# Altium schematic sheet AD7616_BLOCK_B.SchDoc
size A4; SheetNumber: 3; SheetTotal: 16
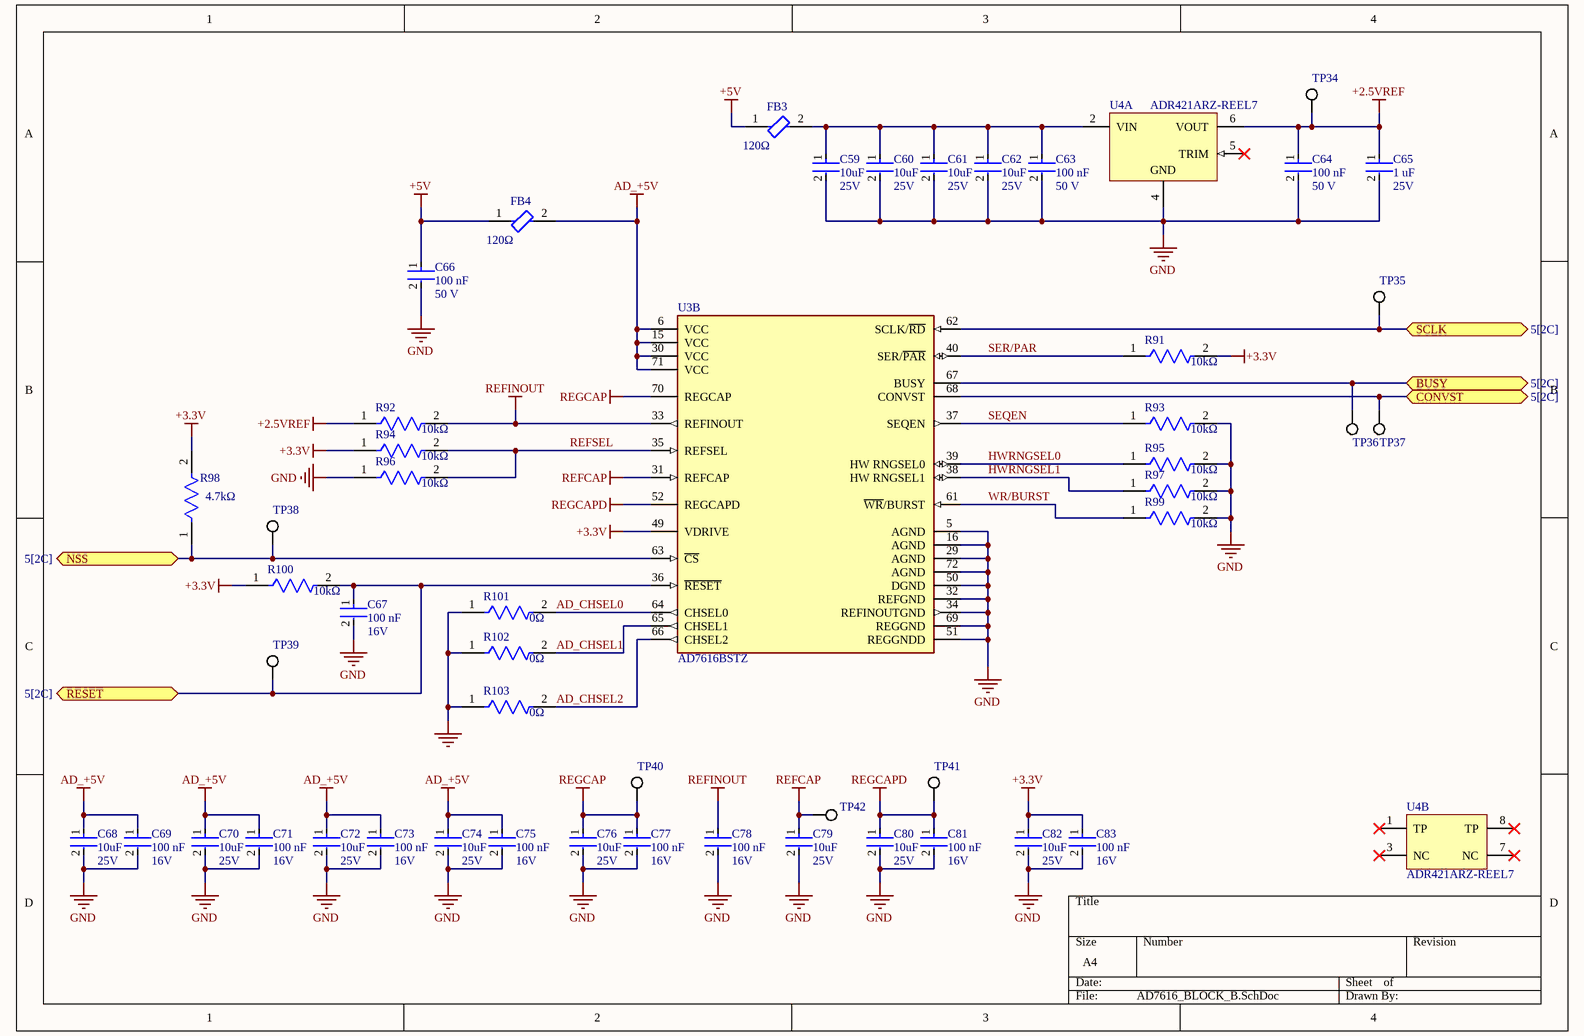
[diagram p0: AD7616_BLOCK_B.SchDoc]

## Parts
C59  Voltage Rating: 25V  Capacitance: 10uF  [FP-C1608-080-IPC_B]  (hidden comment: C1608X5R1E106M080AC)
C60  Voltage Rating: 25V  Capacitance: 10uF  [FP-C1608-080-IPC_B]  (hidden comment: C1608X5R1E106M080AC)
C61  Voltage Rating: 25V  Capacitance: 10uF  [FP-C1608-080-IPC_B]  (hidden comment: C1608X5R1E106M080AC)
C62  Voltage Rating: 25V  Capacitance: 10uF  [FP-C1608-080-IPC_B]  (hidden comment: C1608X5R1E106M080AC)
C63  value 100 nF  Voltage Rating: 50 V  [FP-C0603C-CF-IPC_B]  (hidden comment: C0603C104M5RACTU)
C64  value 100 nF  Voltage Rating: 50 V  [FP-C0603C-CF-IPC_B]  (hidden comment: C0603C104M5RACTU)
C65  Capacitance: 1 uF  Voltage Rating: 25V  [FP-GCM188-0_1-IPC_B]  (hidden comment: GCM188R71E105KA64D)
C66  value 100 nF  Voltage Rating: 50 V  [FP-C0603C-CF-IPC_B]  (hidden comment: C0603C104M5RACTU)
C67  Capacitance: 100 nF  Voltage Rating: 16V  [FP-CL752-IPC_B]  (hidden comment: CL05B104KO5VPNC)
C68  Voltage Rating: 25V  Capacitance: 10uF  [FP-C1608-080-IPC_B]  (hidden comment: C1608X5R1E106M080AC)
C69  Capacitance: 100 nF  Voltage Rating: 16V  [FP-CL752-IPC_B]  (hidden comment: CL05B104KO5VPNC)
C70  Voltage Rating: 25V  Capacitance: 10uF  [FP-C1608-080-IPC_B]  (hidden comment: C1608X5R1E106M080AC)
C71  Capacitance: 100 nF  Voltage Rating: 16V  [FP-CL752-IPC_B]  (hidden comment: CL05B104KO5VPNC)
C72  Voltage Rating: 25V  Capacitance: 10uF  [FP-C1608-080-IPC_B]  (hidden comment: C1608X5R1E106M080AC)
C73  Capacitance: 100 nF  Voltage Rating: 16V  [FP-CL752-IPC_B]  (hidden comment: CL05B104KO5VPNC)
C74  Voltage Rating: 25V  Capacitance: 10uF  [FP-C1608-080-IPC_B]  (hidden comment: C1608X5R1E106M080AC)
C75  Capacitance: 100 nF  Voltage Rating: 16V  [FP-CL752-IPC_B]  (hidden comment: CL05B104KO5VPNC)
C76  Voltage Rating: 25V  Capacitance: 10uF  [FP-C1608-080-IPC_B]  (hidden comment: C1608X5R1E106M080AC)
C77  Capacitance: 100 nF  Voltage Rating: 16V  [FP-CL752-IPC_B]  (hidden comment: CL05B104KO5VPNC)
C78  Capacitance: 100 nF  Voltage Rating: 16V  [FP-CL752-IPC_B]  (hidden comment: CL05B104KO5VPNC)
C79  Voltage Rating: 25V  Capacitance: 10uF  [FP-C1608-080-IPC_B]  (hidden comment: C1608X5R1E106M080AC)
C80  Voltage Rating: 25V  Capacitance: 10uF  [FP-C1608-080-IPC_B]  (hidden comment: C1608X5R1E106M080AC)
C81  Capacitance: 100 nF  Voltage Rating: 16V  [FP-CL752-IPC_B]  (hidden comment: CL05B104KO5VPNC)
C82  Voltage Rating: 25V  Capacitance: 10uF  [FP-C1608-080-IPC_B]  (hidden comment: C1608X5R1E106M080AC)
C83  Capacitance: 100 nF  Voltage Rating: 16V  [FP-CL752-IPC_B]  (hidden comment: CL05B104KO5VPNC)
FB3  Impedance: 120Ω  [FP-BLM18-0_15-t0_5-d1_2-IPC_B]  (hidden comment: BLM18SG121TN1D)
FB4  Impedance: 120Ω  [FP-BLM18-0_15-t0_5-d1_2-IPC_B]  (hidden comment: BLM18SG121TN1D)
R91  Resistance: 10kΩ  [FP-RC0603-0_55-IPC_B]  (hidden comment: RC0603FR-0710KL)
R92  Resistance: 10kΩ  [FP-RC0603-0_55-IPC_B]  (hidden comment: RC0603FR-0710KL)
R93  Resistance: 10kΩ  [FP-RC0603-0_55-IPC_B]  (hidden comment: RC0603FR-0710KL)
R94  Resistance: 10kΩ  [FP-RC0603-0_55-IPC_B]  (hidden comment: RC0603FR-0710KL)
R95  Resistance: 10kΩ  [FP-RC0603-0_55-IPC_B]  (hidden comment: RC0603FR-0710KL)
R96  Resistance: 10kΩ  [FP-RC0603-0_55-IPC_B]  (hidden comment: RC0603FR-0710KL)
R97  Resistance: 10kΩ  [FP-RC0603-0_55-IPC_B]  (hidden comment: RC0603FR-0710KL)
R98  Resistance: 4.7kΩ  [FP-AC0603-IPC_B]  (hidden comment: AC0603FR-074K7L)
R99  Resistance: 10kΩ  [FP-RC0603-0_55-IPC_B]  (hidden comment: RC0603FR-0710KL)
R100  Resistance: 10kΩ  [FP-RC0603-0_55-IPC_B]  (hidden comment: RC0603FR-0710KL)
R101  Resistance: 0Ω  [FP-CRCW0603-HPe3-IPC_B]  (hidden comment: CRCW06030000Z0EAHP)
R102  Resistance: 0Ω  [FP-CRCW0603-HPe3-IPC_B]  (hidden comment: CRCW06030000Z0EAHP)
R103  Resistance: 0Ω  [FP-CRCW0603-HPe3-IPC_B]  (hidden comment: CRCW06030000Z0EAHP)
TP34  5019  [KSTN-5019_V]  (value not drawn)
TP35  5019  [KSTN-5019_V]  (value not drawn)
TP36  5019  [KSTN-5019_V]  (value not drawn)
TP37  5019  [KSTN-5019_V]  (value not drawn)
TP38  5019  [KSTN-5019_V]  (value not drawn)
TP39  5019  [KSTN-5019_V]  (value not drawn)
TP40  5019  [KSTN-5019_V]  (value not drawn)
TP41  5019  [KSTN-5019_V]  (value not drawn)
TP42  5019  [KSTN-5019_V]  (value not drawn)
U3  AD7616BSTZ  [FP-ST-80-2-IPC_B]  (part B of 2)
U4  ADR421ARZ-REEL7  [ADI-R-8_M]  (parts A,B of 2)

## Ports
BUSY (bidir, see 5[2C]), CONVST (bidir, see 5[2C]), NSS (bidir, see 5[2C]), RESET (bidir, see 5[2C]), SCLK (bidir, see 5[2C])

## Nets
+2.5VREF: C64.1 C65.1 R92.1 TP34.1 U4.6(VOUT)
+3.3V: C82.1 C83.1 R91.2 R94.1 R98.2 R100.1 U3.49(VDRIVE)
+5V: C66.1 FB3.1 FB4.1
AD_+5V: C68.1 C69.1 C70.1 C71.1 C72.1 C73.1 C74.1 C75.1 FB4.2 U3.6(VCC) U3.15(VCC) U3.30(VCC) U3.71(VCC)
GND: C59.2 C60.2 C61.2 C62.2 C63.2 C64.2 C65.2 C66.2 C67.2 C68.2 C69.2 C70.2 C71.2 C72.2 C73.2 C74.2 C75.2 C76.2 C77.2 C78.2 C79.2 C80.2 C81.2 C82.2 C83.2 R93.2 R95.2 R96.1 R97.2 R99.2 R101.1 R102.1 R103.1 U3.5(AGND) U3.16(AGND) U3.29(AGND) U3.32(REFGND) U3.34(REFINOUTGND) U3.50(DGND) U3.51(REGGNDD) U3.69(REGGND) U3.72(AGND) U4.4(GND)
REFCAP: C79.1 TP42.1 U3.31(REFCAP)
REFINOUT: C78.1 R92.2 U3.33(REFINOUT)
REGCAP: C76.1 C77.1 TP40.1 U3.70(REGCAP)
REGCAPD: C80.1 C81.1 TP41.1 U3.52(REGCAPD)
AD_CHSEL0: R101.2 U3.64(CHSEL0)
AD_CHSEL1: R102.2 U3.65(CHSEL1)
AD_CHSEL2: R103.2 U3.66(CHSEL2)
BUSY: TP36.1 U3.67(BUSY) ; port BUSY
CONVST: TP37.1 U3.68(CONVST) ; port CONVST
HWRNGSEL0: R95.1 U3.39(HW_RNGSEL0)
HWRNGSEL1: R97.1 U3.38(HW_RNGSEL1)
NSS: R98.1 TP38.1 U3.63(~{CS}) ; port NSS
REFSEL: R94.2 R96.2 U3.35(REFSEL)
RESET: C67.1 R100.2 TP39.1 U3.36(~{RESET}) ; port RESET
SCLK: TP35.1 U3.62(SCLK/~{RD}) ; port SCLK
SEQEN: R93.1 U3.37(SEQEN)
SER/PAR: R91.1 U3.40(SER/~{PAR})
WR/BURST: R99.1 U3.61(~{WR}/BURST)
NetC59_1: C59.1 C60.1 C61.1 C62.1 C63.1 FB3.2 U4.2(VIN)

Not connected (* = marked no-connect by the designer): U4 1(TP)* 3(NC)* 5(TRIM)* 7(NC)* 8(TP)*

## Library data of the parts
C59-C62 C68 C70 C72 C74 C76 C79 C80 C82 = CMP-2000-05442-2: CAP CER 10UF 25V X5R 0603; Dielectric Material: Ceramic; Tolerance: 20%; Dielectric: X5R; Length: 1.6mm; Termination: SMD/SMT; Depth: 0.8mm; RoHS Compliant: Yes; Construction: Flat; Weight: 7.1E-05oz; Thickness: 0.039inch; Packaging: Tape and Reel; Min Operating Temperature: -55°C; Case Code (Imperial): 0603; Case/Package: 0603; Height: 0.8mm; Case Code (Metric): 1608; Resistor Type: Ceramic; Voltage Rating (DC): 25V; Max Operating Temperature: 85°C; REACH SVHC: No SVHC; Lead Free: Lead Free; Series: C; Width: 0.8mm; Mount: Surface Mount; Package Quantity: 1
C63 C64 C66 = CMP-2006-03068-2: CAP CER 0.1UF 50V 20% X7R 0603; Manufacturer: KEMET; Material: Ceramic; Tolerance: 0.2; Temperature Coefficient: 30ppm/°C; Automotive Grade: Grade 1; Capacitance: 0.10 μF; Temperature Range High: +125°C; Device Class L3: Ceramic Capacitors; Manufacturer Part Number: C0603C104M5RACTU; Height: 0.87mm; Category: Cap; RoHS: TRUE; Digikey Description: CAP CER 0.1UF 50V 20% X7R 0603; ComponentLink2URL: https://api.kemet.com/component-edge/download/datasheet/C0603C100J5GACAUTO.pdf; Lead Free: Yes; Temperature Range Low: -55°C; Device Class L1: Passive Components; ComponentLink2Description: Datasheet; Temperature Characteristic: X7R; Automotive: Yes; Temperature: -55°C to +125°C; Octopart: https://octopart.com/c0603c104m5ractu-kemet-11855687; Device Class L2: Capacitors; Package: C0603C-CF; Mouser Description: Multilayer Ceramic Capacitors MLCC - SMD/SMT 50volts 0.1uF X7R 20%
C65 = CMP-2006-02363-4: Manufacturer Lifecycle Status: IN PRODUCTION; NexarPartId: 18909256; Dielectric: X7R; Material: Ceramic; Tolerance: 10%; Thickness: 889µm; Max Operating Temperature: 125°C; Radiation Hardening: No; Weight: 6.293594mg; Lead Free: Lead Free; Mount: Surface Mount; Case Code (Imperial): 0603; REACH SVHC: No SVHC; Lifecycle Status: Production; Depth: 800µm; Min Operating Temperature: -55°C; Height: 800µm; Case Code (Metric): 1608; Case/Package: 0603; Voltage: 25V; Packaging: Cut Tape; Length: 1.6mm; Termination: SMD/SMT; Width: 787.4µm; Voltage Rating (DC): 25V; RoHS: Compliant; Schedule B: 8532240020, 8532240020; Ratings: AEC-Q200
C67 C69 C71 C73 C75 C77 C78 C81 C83 = CMP-13271-002128-1: Cap Ceramic 100nF 16V X7R ±10% SMD 0402 +125°C Paper T/R; Length: 0.039inch; Case Code (Metric): 1005; Thickness: 0.022inch; Max Operating Temperature: 125°C; Mount: Surface Mount; Features: Soft Termination; Width: 0.02inch; Min Operating Temperature: -55°C; Tolerance: 10%; Case/Package: 0402; Packaging: Cut Tape; Ratings: AEC-Q200; Case Code (Imperial): 0402; Lead Free: Lead Free
FB3 FB4 = CMP-0686-00602-4: Chip Ferrite Bead, 0603, 120Ω @ 100MHz, 25%, 0.025Ω, 3A; DC Resistance (DCR): 25mR; Shielding: Unshielded; Material: Steel; Number of Circuits: 1; Tolerance: 25%; REACH SVHC: No SVHC; Case/Package: 0603; Max DC Current: 3A; Core Material: Ferrite; Case Code (Metric): 1608; Frequency: 100MHz; Package Quantity: 1; Height: 0.8mm; Lead Free: Lead Free; Test Frequency: 100MHz; RoHS Compliant: Yes; DC Resistance-Max: 25mR; Min Operating Temperature: -55°C; Width: 0.8mm; Termination: SMD/SMT; Length: 1.6mm; Max Current Rating: 3A; Number of Lines: 1; Series: BLM18S; Number of Pins: 2; Packaging: Tape and Reel; Current Rating: 3A; Depth: 0.8mm; Case Code (Imperial): 0603; Max Operating Temperature: 125°C
R91-R97 R99 R100 = CMP-2100-03664-2: RES 10K OHM 1% 1/10W 0603; Voltage Rating: 75V; Voltage Rating (DC): 50V; Power Rating: 100mW; Temperature Coefficient: 100ppm/°C; Depth: 0.8mm; Termination: SMD/SMT; Resistor Type: Thick Film; Series: RC; Construction: Rectangular; Features: Moisture Resistant; Packaging: Tape and Reel; Min Operating Temperature: -55°C; Number of Terminations: 2; Lead Pitch: 0.3mm; RoHS Compliant: Yes; Case/Package: 0603; Resistance Tolerance: 1%; Military Standard: Not; Weight: 7.1E-05oz; Number of Pins: 2; Tolerance: 1%; Length: 1.6mm; Case Code (Imperial): 0603; Lead Free: Lead Free; Width: 0.8mm; Max Power Dissipation: 100mW; Height: 0.45mm; Max Operating Temperature: 155°C; Case Code (Metric): 1608; Size Code: 0603
R98 = CMP-2000-04847-3: RES 4.7KΩ 1.00% 0.1W 0603; Temperature Coefficient: 100ppm/°C; Max Power Dissipation: 100mW; Voltage Rating: 50V; Tolerance: 1%; Min Operating Temperature: -55°C; Width: 0.031inch; Features: Moisture Resistant; Case/Package: 0603; Number of Terminations: 2; Height: 0.022inch; Case Code (Imperial): 0603; Construction: Rectangular; Length: 0.063inch; Termination: SMD/SMT; Military Standard: Not; Case Code (Metric): 1608; Lead Free: Lead Free; Depth: 0.8mm; Max Operating Temperature: 155°C; Size Code: 0603; RoHS Compliant: Yes; Series: AC; Resistor Type: Thick Film; Ratings: AEC-Q200; Packaging: Tape and Reel; Power Rating: 100mW
R101-R103 = CMP-2000-03817-2: RES Thick Film, 0Ω, , 0.33W, , 0603; Max Power Dissipation: 250mW; Voltage Rating (DC): 75V; Temperature Coefficient: 0ppm/°C; Mount: Surface Mount; Package Quantity: 5000; Features: Automotive AEC-Q200; Length: 1.6mm; Width: 0.033inch; Min Operating Temperature: -55°C; Max Operating Temperature: 155°C; Contact Plating: Tin; Depth: 0.85mm; Case/Package: 0603; Radiation Hardening: No; Military Standard: Not; Power Rating: 250mW; Height: 0.45mm; Composition: Thick Film; Lead Free: Lead Free; Voltage Rating: 75V; Case Code (Imperial): 0603; Weight: 7.1E-05oz; Number of Terminations: 2; Packaging: Tape and Reel; Number of Pins: 2; Case Code (Metric): 1608; Termination: SMD/SMT
TP34-TP42 = CMP-1672-00008-1: Test Point, 1 Position SMD, RoHS, Tape and Reel; ComponentLink1Description: Manufacturer URL; Package Quantity: 1000; DatasheetVersion: 03/2014; Packaging: Tape and Reel; ComponentLink2URL: http://www.keyelco.com/product-pdf.cfm?p=1357; ComponentLink1URL: http://www.keyelco.com/; Mount: Surface Mount; Contact Plating: Silver; PackageDescription: 1-Pin Surface Mount Device, Body 3.81 x 2.03 mm; Pins: 1; RoHSCompliant: True; Mounting Technology: Surface Mount; ComponentLink2Description: Datasheet; PackageReference: 5019
U3 = CMP-09081-000018-1: Number of A/D Converters: 2; Interface: SPI; Sampling Rate: 1000000S/s; Number of Bits: 16; RoHS Compliant: Yes; Max Operating Temperature: 125°C; Case/Package: LQFP; Lead Free: Contains Lead; Min Operating Temperature: -40°C; Number of Pins: 80; Number of Inputs: 16; Packaging: Tray
U4 = CMP-0784-00215-1: Ultraprecision, Low Noise, XFET(R) Voltage Reference, 2.5 V Output, 4.5 to 18 V Supply, Industrial, 8-pin SOIC (R-8), Reel; Manufacturer: Analog Devices; Vout: 2.5V; Max V Supply (V): 18; Min V Supply (V): 4.5; Ref Out TC (ppm/C): 2; Mounting Technology: Surface Mount; ComponentLink4URL: Product URL:http://www.analog.com/en/special-linear-functions/voltage-references/adr421/products/product.html; ComponentLink2Description: Datasheet; Code_JEDEC: MS-012-AA; ComponentLink3Description: Package Specification; ComponentLink1Description: Manufacturer URL; PackageVersion: 060506-A, 06/2006; ComponentLink4Description: URL Link1; PackageReference: R-8; ComponentLink3URL: http://www.analog.com/static/imported-files/packages/PKG_PDF/SOIC_Narrow%20(R)/R_8.pdf; Operating Temp Range: -40 to 125 degC; Packing: Reel; DatasheetVersion: Rev. I; PartNumber: ADR421ARZ-REEL7; ComponentLink2URL: http://www.analog.com/static/imported-files/data_sheets/ADR420_421_423_425.pdf; ComponentLink1URL: http://www.analog.com/en/index.html; PackageDescription: 8-Pin Standard Small Outline Package, Body 4.9 x 3.9 mm, Pitch 1.27 mm